# EAGLE design Vanta-Black v2 (EAGLE 9.6.2)
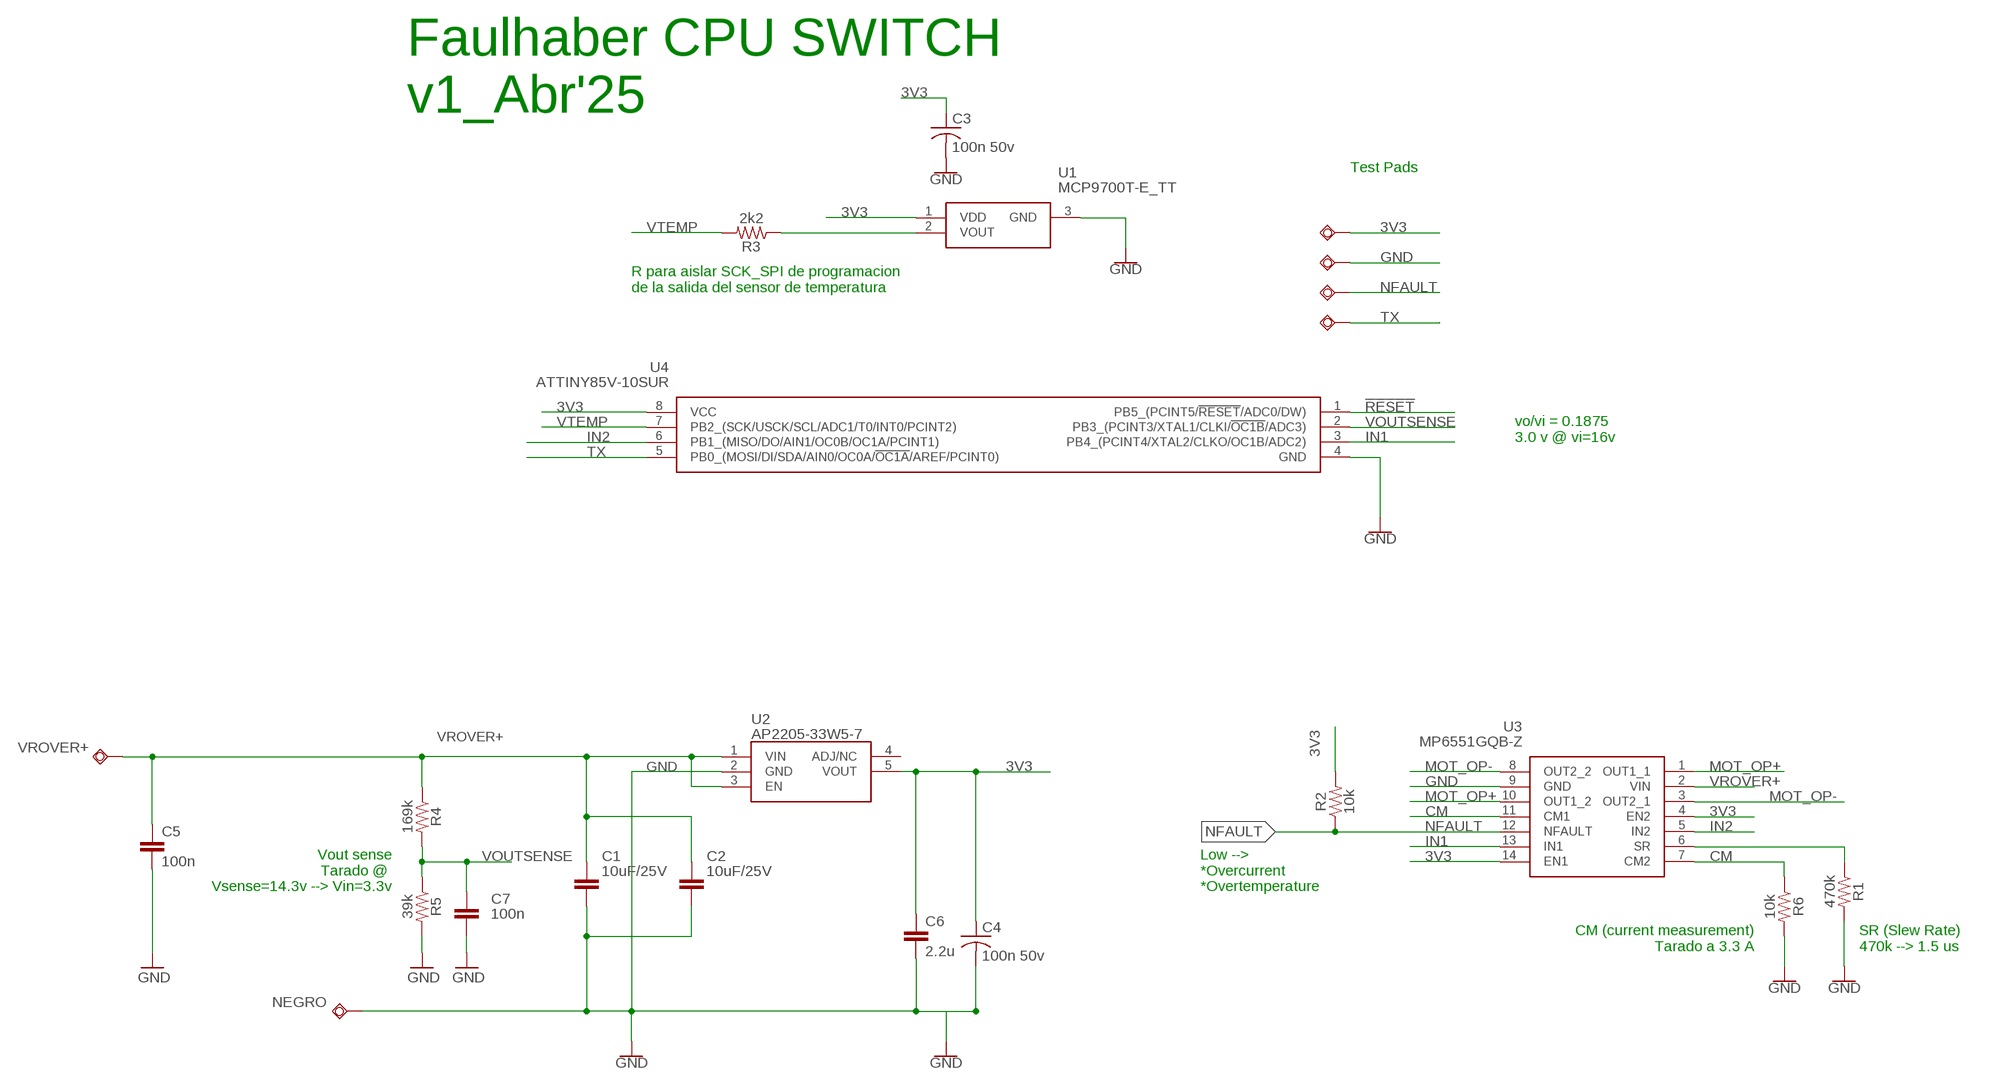
[diagram p0: schematic, sheet 1]

## Parts
3V3  TESTPAD_TPSQB1,27  [TESTPAD_B1,27]
C1  10uF/25V  C_CHIP-0805(2012-METRIC)  [CAPC2012X110]
C2  10uF/25V  C_CHIP-0805(2012-METRIC)  [CAPC2012X110]
C3  100n 50v  C-USC0805  [C0805]
C4  100n 50v  C-USC0805  [C0805]
C5  100n  4.7UF-6.3V-10%(0603)0603  [0603-CAP]
C6  2.2u  4.7UF-6.3V-10%(0603)0603  [0603-CAP]
C7  100n  0.1UF-0603-25V-(+80/-20%)  [0603]
GND  TESTPAD_TPSQB1,27  [TESTPAD_B1,27]
NEGRO  TESTPAD_TPSQTP10SQ  [TESTPAD_TP10SQ]
R1  470k  RESISTOR0603  [0603]
R2  10k  RESISTOR0603  [0603]
R3  2k2  RESISTOR0603  [0603]
R4  169k  RESISTOR0603  [0603]
R5  39k  RESISTOR0603  [0603]
R6  10k  RESISTOR0603  [0603]
U1  MCP9700T-E_TT  [SOT95P237X112-3N]
U2  AP2205-33W5-7  AP2205-W5-7  [SOT95P282X145-5N]
U3  MP6551GQB-Z  [MP6551GQBZ]
U4  ATTINY85V-10SUR  [SOIC127P798X216-8N]
USB+  TESTPAD_TPSQB1,27  [TESTPAD_B1,27]
USB-  TESTPAD_TPSQB1,27  [TESTPAD_B1,27]
VROVER+  TESTPAD_TPSQTP10SQ  [TESTPAD_TP10SQ]

## Nets
3V3: 3V3.TP C3.1 C4.1 C6.1 R2.2 U1.1(VDD) U2.5(VOUT) U3.4(EN2) U3.14(EN1) U4.8(VCC)
!RESET: U4.1(PB5_(PCINT5/!RESET!/ADC0/DW))
CM: R6.1 U3.7(CM2) U3.11(CM1)
GND: C1.2 C2.2 C3.2 C4.2 C5.2 C6.2 C7.2 GND.TP NEGRO.TP R1.2 R5.2 R6.2 U1.3(GND) U2.2(GND) U3.9(GND) U4.4(GND)
IN1: U3.13(IN1) U4.3(PB4_(PCINT4/XTAL2/CLKO/OC1B/ADC2))
IN2: U3.5(IN2) U4.6(PB1_(MISO/DO/AIN1/OC0B/OC1A/PCINT1))
MOT_OP+: U3.1(OUT1_1) U3.10(OUT1_2)
MOT_OP-: U3.3(OUT2_1) U3.8(OUT2_2)
N$1: R3.1 U1.2(VOUT)
N$6: R1.1 U3.6(SR)
NFAULT: R2.1 U3.12(NFAULT) USB+.TP
TX: U4.5(PB0_(MOSI/DI/SDA/AIN0/OC0A/!OC1A!/AREF/PCINT0)) USB-.TP
VOUTSENSE: C7.1 R4.2 R5.1 U4.2(PB3_(PCINT3/XTAL1/CLKI/!OC1B!/ADC3))
VROVER+: C1.1 C2.1 C5.1 R4.1 U2.1(VIN) U2.3(EN) U3.2(VIN) VROVER+.TP
VTEMP: R3.2 U4.7(PB2_(SCK/USCK/SCL/ADC1/T0/INT0/PCINT2))
Unconnected: U2.4(ADJ/NC)

## Notes on the sheet
- Faulhaber CPU SWITCH
  v1_Abr'25
- Test Pads
- R para aislar SCK_SPI de programacion
  de la salida del sensor de temperatura
- vo/vi = 0.1875
  3.0 v @ vi=16v
- Vout sense
  Tarado @ 
  Vsense=14.3v --> Vin=3.3v
- Low -->
  *Overcurrent
  *Overtemperature
- CM (current measurement)
  Tarado a 3.3 A
- SR (Slew Rate)
  470k --> 1.5 us

## Library data of the parts
3V3 GND NEGRO USB+ USB- VROVER+ = BeagleBone_Blue_R3:TESTPAD_TPSQ: Test pad
C1 C2 = Capacitor:C: Capacitor - Generic; CATEGORY: Capacitor
C3 C4 = adafruit:C-US: CAPACITOR, American symbol
C5 C6 = SparkFun-Capacitors:4.7UF-6.3V-10%(0603): CAP-08280; PROD_ID: CAP-08280; VALUE: 4.7uF
C7 = SparkFun-Capacitors:0.1UF: 0.1µF ceramic capacitors A capacitor is a passive two-terminal electrical component used to store electrical energy temporarily in an electric field.; PROD_ID: CAP-00810; VALUE: 0.1uF
R1-R6 = SparkFun-Resistors:RESISTOR: Generic Resistor Package
U1 = SamacSys_Parts:MCP9700T-E_TT: Linear Active Thermistor 10mV/C SOT23 Source: Datasheet <https://datasheet.datasheetarchive.com/originals/distributors/Datasheets-DGA2/179941.pdf>; ARROW_PART_NUMBER: MCP9700T-E/TT; ARROW_PRICE-STOCK: https://www.arrow.com/en/products/mcp9700t-ett/microchip-technology?utm_currency=USD&region=nac; DESCRIPTION: Linear Active Thermistor 10mV/C SOT23; HEIGHT: 1.12mm; MANUFACTURER_NAME: Microchip; MANUFACTURER_PART_NUMBER: MCP9700T-E/TT; MOUSER_PART_NUMBER: 579-MCP9700T-E/TT; MOUSER_PRICE-STOCK: https://www.mouser.co.uk/ProductDetail/Microchip-Technology/MCP9700T-E-TT?qs=QVBMgXxBiLyzQ04uBGj3mg%3D%3D
U2 = AP2205-W5-7:AP2205-W5-7: LDO Voltage Regulators LDO CMOS LowCurr Source: Datasheet <https://www.diodes.com/assets/Datasheets/AP2206.pdf>; DESCRIPTION: LDO Voltage Regulators LDO CMOS LowCurr; HEIGHT: 1.45mm; MANUFACTURER_NAME: Diodes Inc.; MANUFACTURER_PART_NUMBER: AP2205-W5-7; MOUSER_PART_NUMBER: 621-AP2205-W5-7; MOUSER_PRICE-STOCK: https://www.mouser.com/Search/Refine.aspx?Keyword=621-AP2205-W5-7
U3 = SamacSys_Parts:MP6551GQB-Z: Motor / Motion / Ignition Controllers & Drivers 2.5V -14V, 5A H-bridge motor driver Source: Datasheet <https://www.monolithicpower.com/en/documentview/productdocument/index/version/2/document_type/Datasheet/lang/en/sku/MP6551GQB/document_id/9795/>; DESCRIPTION: Motor / Motion / Ignition Controllers & Drivers 2.5V -14V, 5A H-bridge motor driver; HEIGHT: 1mm; MANUFACTURER_NAME: Monolithic Power Systems (MPS); MANUFACTURER_PART_NUMBER: MP6551GQB-Z; MOUSER_PART_NUMBER: 946-MP6551GQB-Z; MOUSER_PRICE-STOCK: https://www.mouser.co.uk/ProductDetail/Monolithic-Power-Systems-MPS/MP6551GQB-Z?qs=TCDPyi3sCW05a7HtnXBJ6g%3D%3D
U4 = SamacSys_Parts:ATTINY85V-10SUR: MICROCHIP - ATTINY85V-10SUR - MCU, 8BIT, AVR, 10MHZ, WSOIC-8 Source: Datasheet <https://componentsearchengine.com/Datasheets/2/ATTINY85V-10SUR.pdf>; DESCRIPTION: MICROCHIP - ATTINY85V-10SUR - MCU, 8BIT, AVR, 10MHZ, WSOIC-8; FARNELL2_PART_NUMBER: 2851618RL; FARNELL2_PRICE-STOCK: http://uk.farnell.com/jsp/displayProduct.jsp?sku=2851618RL&action=view; HEIGHT: 2.16mm; MANUFACTURER_NAME: Microchip; MANUFACTURER_PART_NUMBER: ATTINY85V-10SUR

## Board
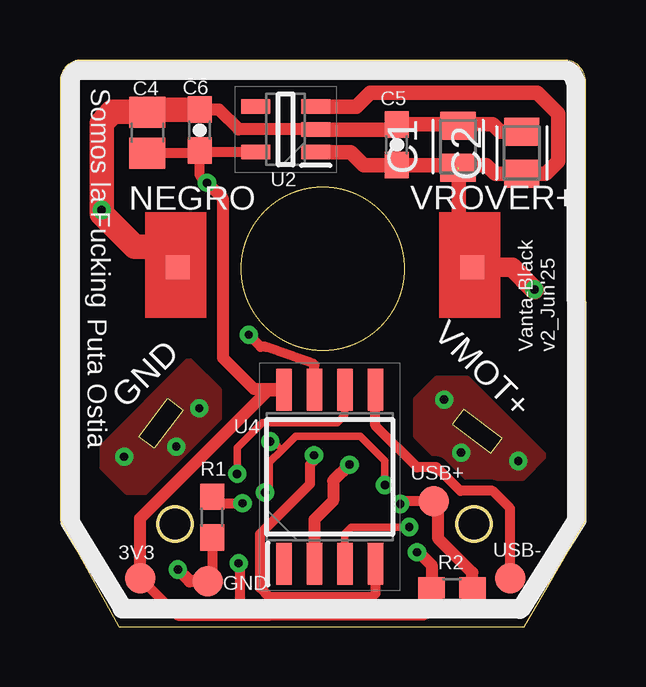
[diagram p1: board, top side]
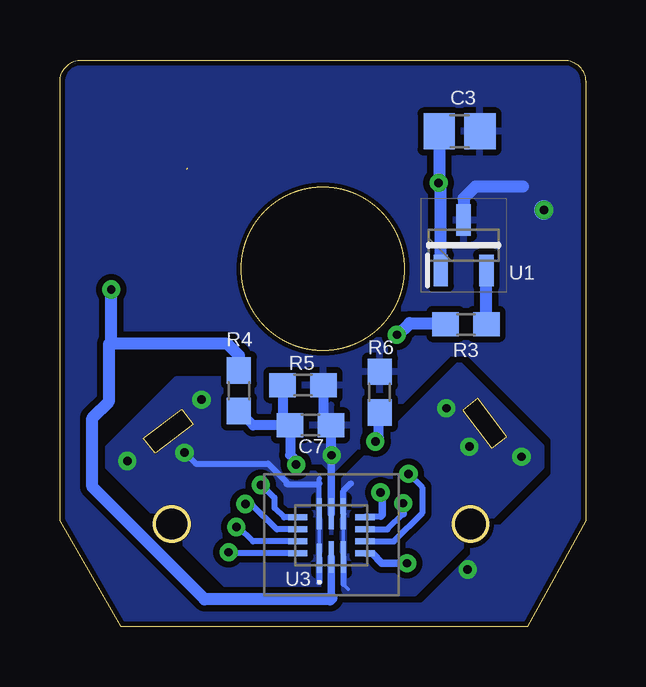
[diagram p2: board, bottom side, seen from below]

Size 21.9 x 23.62 mm. Coordinates in mm from the lower left corner, seen from the top.
Outline: 16.83,9.07 16.35,8.43 17.94,7.22 18.42,7.86 16.83,9.07
Outline: 5.13,9.03 3.92,7.44 3.28,7.92 4.49,9.52 5.13,9.03
Outline: 21.9,22.72 arc90 21,23.62 0.9,23.62 arc90 0,22.72 0,4.42 2.44,0 19.34,0 21.9,4.42 21.9,22.72
Outline: circle at 10.94,14.91 radius 3.4
Outline: circle at 4.8,4.28 radius 0.71
Outline: circle at 17.24,4.28 radius 0.71
Copper layers (1*16): Top 0.035mm / dielectric 1.5mm / Bottom 0.035mm
Design rules "default *": minimum track width 6mil, minimum drill 0.35mm, track to track 10mil, track to pad 10mil, pad to pad 10mil, via to via 10mil, smd to smd 0mil, copper to edge 1mil, drill to drill 6mil, minimum pad ring 10mil, minimum via ring 8mil, stop-mask expansion 4mil, vias tented up to drill 0mil, thermal gap 10mil
vRestrict: area 14.6,9.2 to 15.3,10.5

### Footprints (pad centres in the part's own frame; a part is rotated, then mirrored left to right if it is on the bottom)
TESTPAD_B1,27 = smd 1.27 x 1.27: TP 0,0
CAPC2012X110 = smd 1.165 x 1.465: 1 -0.875,0; 2 0.875,0
C0805 = smd 1.3 x 1.5: 1 -0.85,0; 2 0.85,0
0603-CAP = smd 1.1 x 1: 1 -0.85,0; 2 0.85,0
0603 = smd 1.1 x 1: 1 -0.85,0; 2 0.85,0
TESTPAD_TP10SQ = smd 1 x 1: TP 0,0
SOT95P237X112-3N = smd 1.3 x 0.6: 1 -1.05,0.95; 2 -1.05,-0.95; 3 1.05,0
SOT95P282X145-5N = smd 1.2 x 0.6: 1 -1.25,0.95; 2 -1.25,0; 3 -1.25,-0.95; 4 1.25,-0.95; 5 1.25,0.95
MP6551GQBZ = smd 1.2 x 0.2: 1 -0.95,0.5 | smd 1.3 x 0.2: 2 -0.9,0; 3 -0.9,-0.5; 8 0.9,-0.5; 9 0.9,0; 10 0.9,0.5 | smd 0.25 x 0.8: 4 -0.75,-1.4; 5 -0.25,-1.4; 6 0.25,-1.4; 7 0.75,-1.4; 11 0.75,1.4; 12 0.25,1.4; 13 -0.25,1.4; 14 -0.75,1.4
SOIC127P798X216-8N = smd 1.75 x 0.65: 1 -3.625,1.905; 2 -3.625,0.635; 3 -3.625,-0.635; 4 -3.625,-1.905; 5 3.625,-1.905; 6 3.625,-0.635; 7 3.625,0.635; 8 3.625,1.905

### Placement (x,y rotation side)
3V3  3.34,2.03 0 top
C1  16.58,20.01 90 top
C2  19.24,19.75 90 top
C3  5.25,20.65 0 bottom
C4  3.64,20.59 90 top
C5  14.03,20.09 90 top
C6  5.82,20.7 90 top
C7  11.46,8.4 0 bottom
GND  6.16,1.9 0 top
NEGRO  4.9,14.99 0 top
R1  6.33,4.57 270 top
R2  16.33,1.56 180 top
R3  4.98,12.61 180 bottom
R4  14.44,9.84 270 bottom
R5  11.77,10.07 0 bottom
R6  8.57,9.78 90 bottom
U1  5.08,15.9 90 bottom
U2  9.4,20.73 180 top
U3  10.59,3.81 90 bottom
U4  11.24,6.25 90 top
USB+  15.56,5.23 0 top
USB-  18.75,2.03 0 top
VROVER+  17.18,14.99 0 top

### Tracks (layer width: path | path; a pad name or v marks a point on that pad's centre or on a via)
3V3  (via drill 0.35)
  Top 0.406: 8.73,0.49 7.95,0.49 7.49,0.95 7.49,2.6 v7.44,2.65 | 8.73,0.49 8.75,0.47 4.9,0.47 3V3.TP | U2.5 5.89,19.78 C6.1 | C6.1 5.71,19.74 C4.1 | v6.12,18.5 5.82,18.8 C6.1 | R2.2 15.49,0.79 15.19,0.49 8.73,0.49
  Top 0.508: v6.12,18.5 6.79,17.83 6.79,11.2 8.09,9.91 9.3,9.91 U4.8 9.3,9.85 8.66,9.85 3.34,4.52 3V3.TP | v14.87,3.11 14.94,3.11 15.48,2.57 R2.2
  Bottom 0.254: U3.4 9.17,3.04 8.87,3.04 | U3.14 14.82,3.06
  Bottom 0.305: 8.87,3.04 8.48,2.65 v7.44,2.65 | 14.82,3.06 v14.87,3.11
  Bottom 0.508: U1.1 6.06,14.88 6.06,18.44 v6.12,18.5 6.1,18.52 C3.1
CM  (via drill 0.35)
  Top 0.254: v8.76,7.73 8.93,7.73 9.26,7.39
  Top 0.305: v13.53,5.91 13.53,6.92 12.51,7.94 9.81,7.94 9.26,7.39 8.72,6.85 8.72,5.78 v8.54,5.6
  Bottom 0.203: v8.54,5.6 8.48,5.66
  Bottom 0.254: U3.7 9.16,4.6 8.54,4.6 | U3.11 12.56,4.56 12.96,4.96 12.96,5.39 13.48,5.91 | 8.76,7.95 v8.76,7.73
  Bottom 0.305: 8.54,4.6 8.46,4.68 8.46,5.64 8.48,5.66 | 8.61,8.89 R6.1 | v13.53,5.91 13.48,5.91
  Bottom 0.406: v8.76,7.73 8.61,7.87 8.61,8.89
GND  (via drill 0.35)
  Top 0.406: R1.2 6.33,2.07 GND.TP | U4.4 13.14,1.39 12.99,1.24 8.72,1.24 8.34,1.62 8.34,3.88 10.41,5.95 10.41,6.77 10.58,6.94 v10.58,7.15
  Top 0.508: U2.2 7.44,20.73 6.62,21.55 C6.2 | GND.TP 5.4,1.9 v4.91,2.39 | C5.2
  Top 0.61: U2.2 14.04,20.72 14.14,20.82 14.14,20.84 C5.2 16.53,20.94 | 16.53,20.94 C1.2 | C2.2 18.34,20.63 18.02,20.94 16.53,20.94
  Top 1.016: 4.09,15.8 NEGRO.TP 4.05,15.84 3.11,15.84 1.74,17.21 v1.74,17.37 1.74,20.98 2.17,21.46 3.62,21.46 C4.2 3.75,21.55 C6.2
  Bottom 0.305: C7.2 10.59,8.38 | 10.59,8.28 U3.9
  Bottom 0.406: R5.2 10.92,8.71 C7.2 | v10.58,7.15 v10.59,7.16 10.59,8.28 10.59,8.38
  Bottom 0.508: U1.3 5.08,17.85 4.58,18.35 2.6,18.35
  Bottom 0.813: v1.74,17.37 v1.74,17.36
  pour Bottom (isolate 0.2, rank 2): 0.04,24.1 21.54,24.1 22.64,23 22.64,2.05 18.8,-1.79 2.21,-1.79 -0.61,1.03 -0.61,23.45
IN1  (via drill 0.35)
  Top 0.305: v14.55,4.16 12.14,4.16 11.87,3.89 U4.3
  Bottom 0.254: U3.13 13.86,3.56 14.46,4.16
  Bottom 0.305: 14.46,4.16 v14.55,4.16
IN2  (via drill 0.35)
  Top 0.305: v7.38,6.38 7.38,7.46 8.43,8.51 11.54,8.51 11.87,8.84 U4.6
  Bottom 0.254: v7.38,6.38 6.81,5.81 6.81,4.74 7.99,3.56 U3.5
MOT_OP+  (via drill 0.35)
  Bottom 0.152: U3.1 U3.10 | 11.09,1.87 11.15,1.81
  Bottom 0.203: U3.10 11.09,5.98 11.09,6.18
  Bottom 0.254: v16.71,7.26 16.25,6.8 13.22,6.8 12.45,6.03 12.45,5.95 11.12,5.95 11.09,5.98 | U3.1 11.09,1.87
  other vias: 16,9.47 19.09,6.91
  pour Top: 14.87,9.46 15.72,10.31 16.95,10.31 20.14,7.12 19.26,6.24 16.6,6.24 14.87,7.97
  pour Bottom: 10.89,5.94 15.25,10.3 17.03,10.3 19.92,7.41 19.92,6.74 14.38,1.2 10.89,1.2
MOT_OP-  (via drill 0.35)
  Bottom 0.152: U3.3 U3.8 | 10.09,1.78 9.88,1.57
  Bottom 0.254: U3.3 10.09,1.78 | U3.8 10.09,5.67 9.78,5.98
  other vias: 2.67,7.09 5.8,9.11 4.84,7.51
  pour Bottom: 7.13,1.42 1.87,6.68 1.87,7.5 5.27,10.9 10.33,5.83 10.33,1.42
  pour Top: 2.79,5.66 1.79,6.66 1.79,7.48 5.37,11.06 6.58,9.85 6.58,8.7 3.54,5.66
N$1
  Bottom 0.508: R3.1 U1.2
N$6  (via drill 0.35)
  Top 0.406: v7.6,5.15 7.44,5.15 7.45,5.14 6.61,5.14 R1.1
  Bottom 0.254: U3.6 8.26,4.06 7.6,4.72
  Bottom 0.305: 7.6,4.72 v7.6,5.15
NFAULT  (via drill 0.35)
  Top 0.406: USB+.TP 14.36,5.23 14.25,5.12 v14.18,5.12
  Top 0.508: R2.1 17.18,2.26 15.74,3.7 15.74,5.05 USB+.TP
  Bottom 0.254: U3.12 12.86,4.06 13.92,5.12
  Bottom 0.305: v14.18,5.12 13.92,5.12
TX
  Top 0.406: USB-.TP 18.75,4.94 18.02,5.67 16.68,5.67 15.7,6.65 14.88,6.65 13.14,8.39 U4.5
  Top 0.508: U4.5 13.09,9.83
VOUTSENSE  (via drill 0.35)
  Top 0.508: v12.06,6.76 11.38,6.08 11.38,5.25 10.6,4.47 U4.2
  Bottom 0.406: C7.1 13.85,8.4 R4.2 | R5.1 12.62,8.71 C7.1 | C7.1 12.31,7.17 12.06,6.92 v12.06,6.76
VROVER+  (via drill 0.35)  (1 unrouted)
  Top 0.61: 14.19,19.09 C5.1 | VROVER+.TP 16.61,15.56 16.61,19.08 | U2.3 12.35,21.68 12.92,22.25 19.88,22.25 20.76,21.37 20.76,19.4 20.24,18.88 C2.1 18.13,18.88 17.76,19.24 16.69,19.24 C1.1 16.48,19.24 C5.1 | U2.1 12.12,19.78 12.66,19.24 C5.1
  Top 0.813: VROVER+.TP 18.84,14.99 v19.77,14.06
  Bottom 0.305: U3.2 10.59,1.2
  Bottom 0.508: 19.77,11.79 14.92,11.79 14.44,11.31 R4.1 | 19.77,11.79 19.86,11.79 19.86,9.4 20.55,8.71 20.55,5.83 15.87,1.15 10.64,1.15 10.59,1.2 | 19.77,11.79 v19.77,14.06
VTEMP  (via drill 0.35)
  Top 0.406: U4.7 10.6,10.92 10.56,10.96 8.57,11.67 8.36,11.67 v7.86,12.17
  Bottom 0.508: v7.86,12.17 7.82,12.17 7.33,12.66 5.88,12.66 R3.2
(copper drawn outside any net)
  shapes: Top area x2

### Text on the board
tPlace: Somos la Fucking | Vanta-Black / v2_Jun'25 | Puta Ostia | VMOT+ | GND